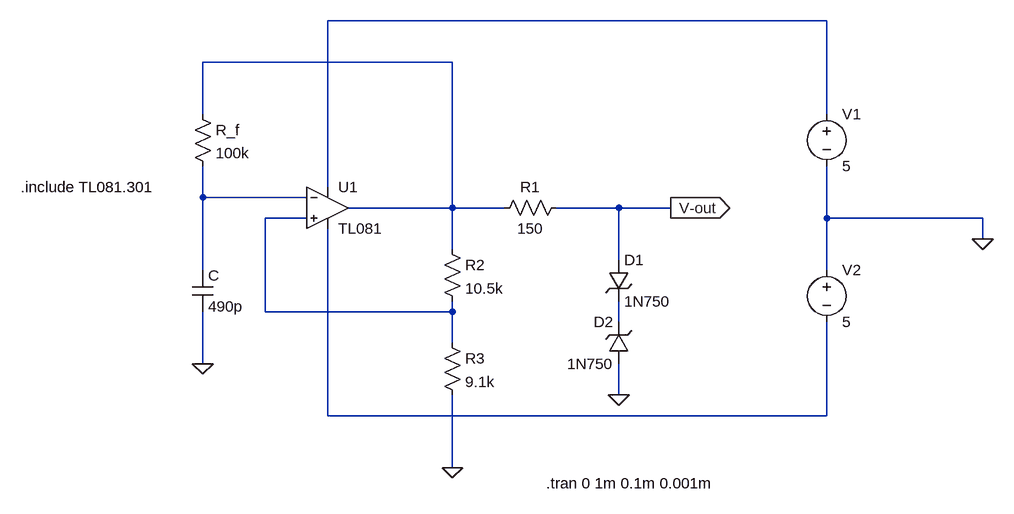
[diagram p0: schematic Square pluse.asc]
Square pluse.asc, the LTspice schematic file:
Version 4
SHEET 1 1180 680
WIRE 576 -448 -192 -448
WIRE 0 -384 -384 -384
WIRE -384 -304 -384 -384
WIRE 576 -304 576 -448
WIRE -192 -192 -192 -448
WIRE -384 -176 -384 -224
WIRE -224 -176 -384 -176
WIRE 0 -160 0 -384
WIRE 0 -160 -160 -160
WIRE 80 -160 0 -160
WIRE 256 -160 160 -160
WIRE 336 -160 256 -160
WIRE -224 -144 -288 -144
WIRE 576 -144 576 -224
WIRE 816 -144 576 -144
WIRE 816 -112 816 -144
WIRE 0 -96 0 -160
WIRE 256 -80 256 -160
WIRE -384 -64 -384 -176
WIRE 576 -64 576 -144
WIRE -288 0 -288 -144
WIRE 0 0 0 -16
WIRE 0 0 -288 0
WIRE 256 16 256 -16
WIRE 0 48 0 0
WIRE -384 80 -384 0
WIRE 256 128 256 80
WIRE -192 160 -192 -128
WIRE 576 160 576 16
WIRE 576 160 -192 160
WIRE 0 240 0 128
FLAG 0 240 0
FLAG -384 80 0
FLAG 336 -160 V-out
IOPIN 336 -160 Out
FLAG 816 -112 0
FLAG 256 128 0
SYMBOL res -400 -320 R0
SYMATTR InstName R_f
SYMATTR Value 100k
SYMBOL res -16 -112 R0
SYMATTR InstName R2
SYMATTR Value 10.5k
SYMBOL res -16 32 R0
SYMATTR InstName R3
SYMATTR Value 9.1k
SYMBOL cap -400 -64 R0
SYMATTR InstName C
SYMATTR Value 490p
SYMBOL OpAmps\\opamp2 -192 -224 R0
SYMATTR InstName U1
SYMATTR Value TL081
SYMBOL voltage 576 -320 R0
WINDOW 123 0 0 Left 0
WINDOW 39 0 0 Left 0
SYMATTR InstName V1
SYMATTR Value 5
SYMBOL voltage 576 -80 R0
WINDOW 123 0 0 Left 0
WINDOW 39 0 0 Left 0
SYMATTR InstName V2
SYMATTR Value 5
SYMBOL res 64 -144 R270
WINDOW 0 32 56 VTop 2
WINDOW 3 0 56 VBottom 2
SYMATTR InstName R1
SYMATTR Value 150
SYMBOL zener 240 -80 R0
SYMATTR InstName D1
SYMATTR Value 1N750
SYMBOL zener 272 80 R180
WINDOW 0 24 64 Left 2
WINDOW 3 24 0 Left 2
SYMATTR InstName D2
SYMATTR Value 1N750
TEXT -664 -192 Left 2 !.include TL081.301
TEXT 144 264 Left 2 !.tran 0 1m 0.1m 0.001m

The netlist it stands for:
* Square pluse.asc
R_f N002 N003 100k
R2 N002 N004 10.5k
R3 N004 0 9.1k
C N003 0 490p
XU1 N004 N003 N001 N006 N002 TL081  ; pins In+ In- V+ V- OUT
V1 N001 0 5
V2 0 N006 5
R1 N002 V-out 150
D1 V-out N005 1N750
D2 0 N005 1N750
.model D D
.lib standard.dio
.include TL081.301
.tran 0 1m 0.1m 0.001m
.backanno
.end